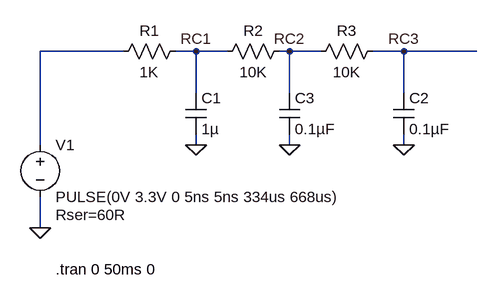
[diagram p0: schematic PWM filter-1.asc]
PWM filter-1.asc, the LTspice schematic file:
Version 4
SHEET 1 996 680
WIRE 416 80 288 80
WIRE 528 80 496 80
WIRE 576 80 528 80
WIRE 672 80 656 80
WIRE 720 80 672 80
WIRE 848 80 800 80
WIRE 960 80 848 80
WIRE 528 144 528 80
WIRE 672 144 672 80
WIRE 848 144 848 80
WIRE 288 224 288 80
WIRE 528 224 528 208
WIRE 672 224 672 208
WIRE 848 224 848 208
WIRE 288 352 288 304
FLAG 288 352 0
FLAG 528 224 0
FLAG 848 224 0
FLAG 672 224 0
FLAG 528 80 RC1
FLAG 672 80 RC2
FLAG 848 80 RC3
SYMBOL voltage 288 208 R0
WINDOW 123 0 0 Left 2
WINDOW 39 24 124 Left 2
SYMATTR SpiceLine Rser=60R
SYMATTR InstName V1
SYMATTR Value PULSE(0V 3.3V 0 5ns 5ns 334us 668us)
SYMBOL res 512 64 R90
WINDOW 0 0 56 VBottom 2
WINDOW 3 32 56 VTop 2
SYMATTR InstName R1
SYMATTR Value 1K
SYMBOL cap 512 144 R0
SYMATTR InstName C1
SYMATTR Value 1µ
SYMATTR SpiceLine V=10 Irms=0 Rser=0.009 Lser=0 mfg="TDK" pn="C1608X5RIA105K" type="X5R"
SYMBOL res 672 64 R90
WINDOW 0 0 56 VBottom 2
WINDOW 3 32 56 VTop 2
SYMATTR InstName R2
SYMATTR Value 10K
SYMBOL cap 832 144 R0
SYMATTR InstName C2
SYMATTR Value 0.1µF
SYMATTR SpiceLine V=10 Irms=0 Rser=0.009 Lser=0
SYMBOL cap 656 144 R0
SYMATTR InstName C3
SYMATTR Value 0.1µF
SYMBOL res 816 64 R90
WINDOW 0 0 56 VBottom 2
WINDOW 3 32 56 VTop 2
SYMATTR InstName R3
SYMATTR Value 10K
TEXT 312 416 Left 2 !.tran 0 50ms 0

The netlist it stands for:
* PWM filter-1.asc
V1 N001 0 PULSE(0V 3.3V 0 5ns 5ns 334us 668us) Rser=60R
R1 RC1 N001 1K
C1 RC1 0 1µ V=10 Irms=0 Rser=0.009 Lser=0 mfg="TDK" pn="C1608X5RIA105K" type="X5R"
R2 RC2 RC1 10K
C2 RC3 0 0.1µF V=10 Irms=0 Rser=0.009 Lser=0
C3 RC2 0 0.1µF
R3 RC3 RC2 10K
.tran 0 50ms 0
.backanno
.end